# Altium schematic sheet EntradaSensorTemperatura.SchDoc: CONTROLADORA AIRPOPCORN
size A3; DocumentNumber: 10.00.0025; SheetNumber: 7; SheetTotal: 16
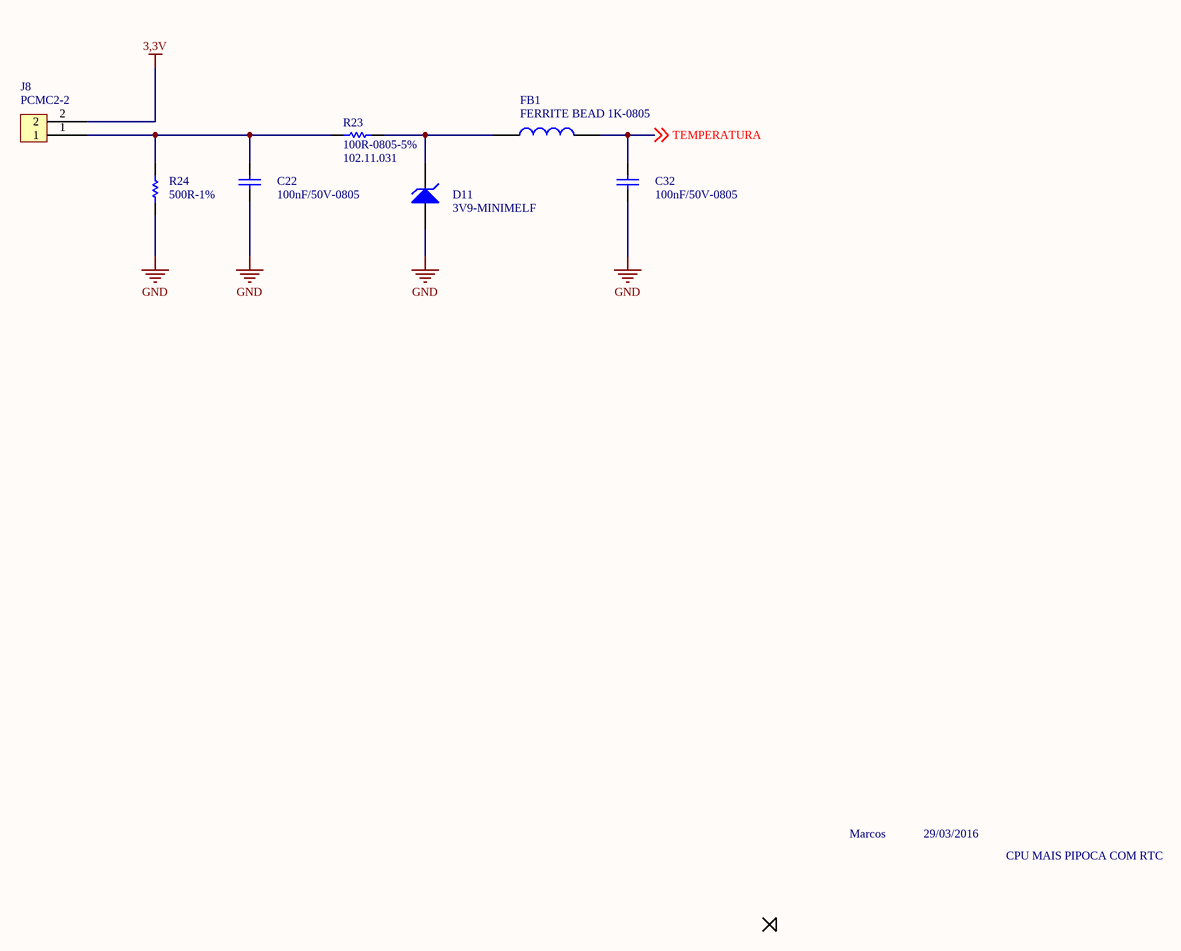
[diagram p0: EntradaSensorTemperatura.SchDoc]

## Parts
C22  100nF/50V-0805  [0805-REVISADO O]
C32  100nF/50V-0805  [0805-REVISADO O]
D11  3V9-MINIMELF  [MINIMLEF/SOD80]
FB1  FERRITE BEAD 1K-0805  [0805-REVISADO O]
J8  PCMC2-2  [PCMC2-2]
R23  100R-0805-5%  ERP: 102.11.031  [0805-REVISADO O]
R24  500R-1%  [0805-REVISADO O]

## Nets
3,3V: J8.2
GND: C22.1 C32.1 D11.1(A) R24.1
TEMPERATURA: C32.2 FB1.2 ; off-sheet TEMPERATURA
NetC22_2: C22.2 J8.1 R23.1 R24.2
NetD11_2: D11.2(K) FB1.1 R23.2

## Notes on the sheet
- Marcos
- 29/03/2016
- CPU MAIS PIPOCA COM RTC
- NOME
- DATA
- PROJETO
- DESCRIÇÃO
- www.quarktee.com.br
- desenho
- verif.
- aprov.
- TAMANHO
- CODIGO
- Todas as informações disponíveis
- não devem ser divulgadas,
- em parte ou todo.
- CIRCUITO IMPRESSO
- MONTAGEM ELETRÔNICA
- A4
- de

## Library data of the parts
C22 C32 = 100nF/50-0805-NPO: ERP: 104.11.005
D11 = ZENER 3V3-SOD80: 3V3-SOD80-1/2W; ERP: 120.19.005
R24 = 10K-0805-5%: ERP: 102.11.054
FB1 = FERRITE BEAD 1K-0805: ERP: 123.02.001